# Altium schematic sheet 01-Revision_History_and_Contents.SchDoc: Revision History and Contents
size A; Date: 01/08/2018; ApprovedBy: JSK; CheckedBy: JSK; Author: JSK; CompanyName: University of Wisconsin; DrawnBy: JSK; Engineer: JSK; Organization: ECE 315; Address1: College of Engineering; Address2: 1415 Engineering Drive; Address3: Madison, WI 53706; Address4: ECE 315 Spring 2017; Revision: A; SheetNumber: 1; SheetTotal: 6
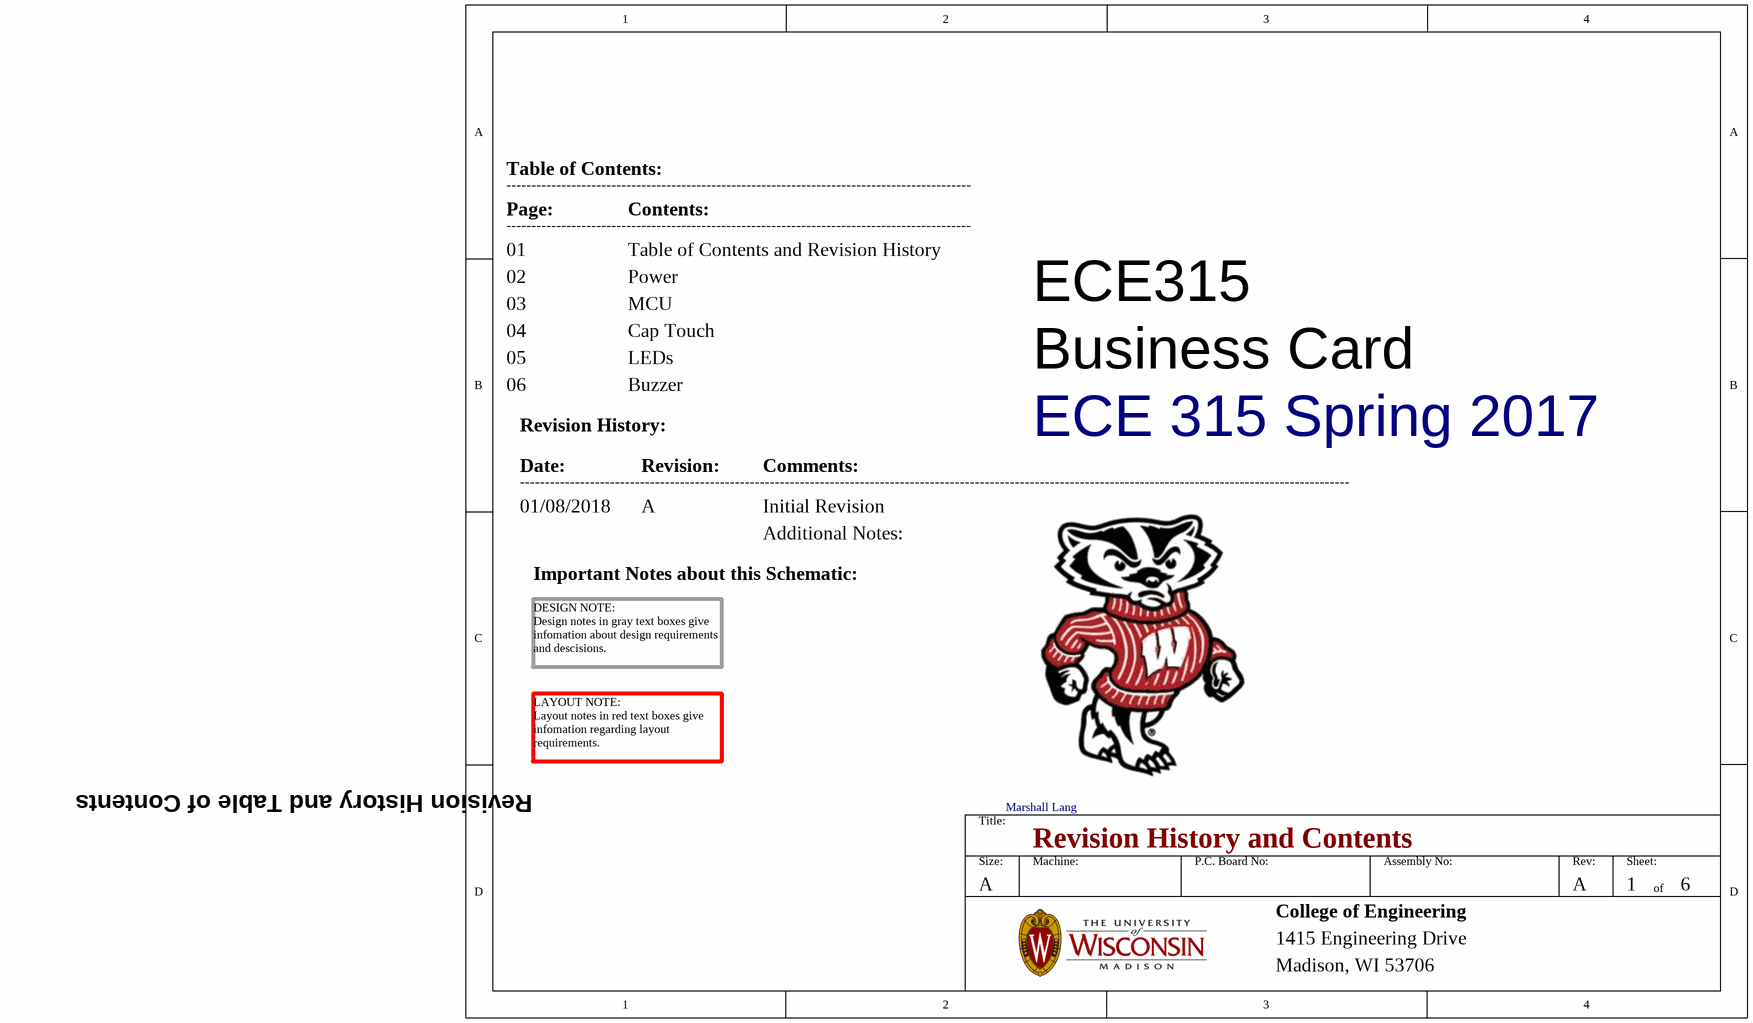
[diagram p0: 01-Revision_History_and_Contents.SchDoc]

## Notes on the sheet
- Table of Contents:
- Page:
- ---------------------------------------------------------------------------------------------
- Contents:
- 01
- 02
- Table of Contents and Revision History
- Power
- 03
- 04
- 05
- MCU
- Cap Touch
- LEDs
- ECE315
- 06
- Revision History:
- Buzzer
- Business Card
- Date:
- ----------------------------------------------------------------------------------------------------------------------------------------------------------------------
- Revision:
- Comments:
- 01/08/2018
- A
- Initial Revision
- Additional Notes:
- Important Notes about this Schematic:
- DESIGN NOTE:
  Design notes in gray text boxes give infomation about design requirements and descisions.
- LAYOUT NOTE:
  Layout notes in red text boxes give infomation regarding layout requirements.
- Revision History and Table of Contents
- Marshall Lang
- Title:
- Size:
- Machine:
- P.C. Board No:
- Assembly No:
- Rev:
- Sheet:
- of
- College of Engineering
- 1415 Engineering Drive
- Madison, WI 53706